# Altium project B100.PrjPcb (part 3 of 7)

## Sheet MicroController.SchDoc: MicroController Block Diagram
size A3; ApprovedBy: Mehmet Günce Akkoyun; CheckedBy: Mehmet Günce Akkoyun; CompanyName: Ovoo Electronics; DrawnBy: Mehmet Günce Akkoyun; Engineer: Mehmet Günce Akkoyun; Organization: Ovoo Electronics; Address1: Necip Fazıl Mah. Ortaırmak Sok.; Address2: Birgül Apt. No: 19/6; Address3: Meram / Konya; Address4: Turkiye; DocumentNumber: 14; Revision: R06; SheetNumber: 14; SheetTotal: 54
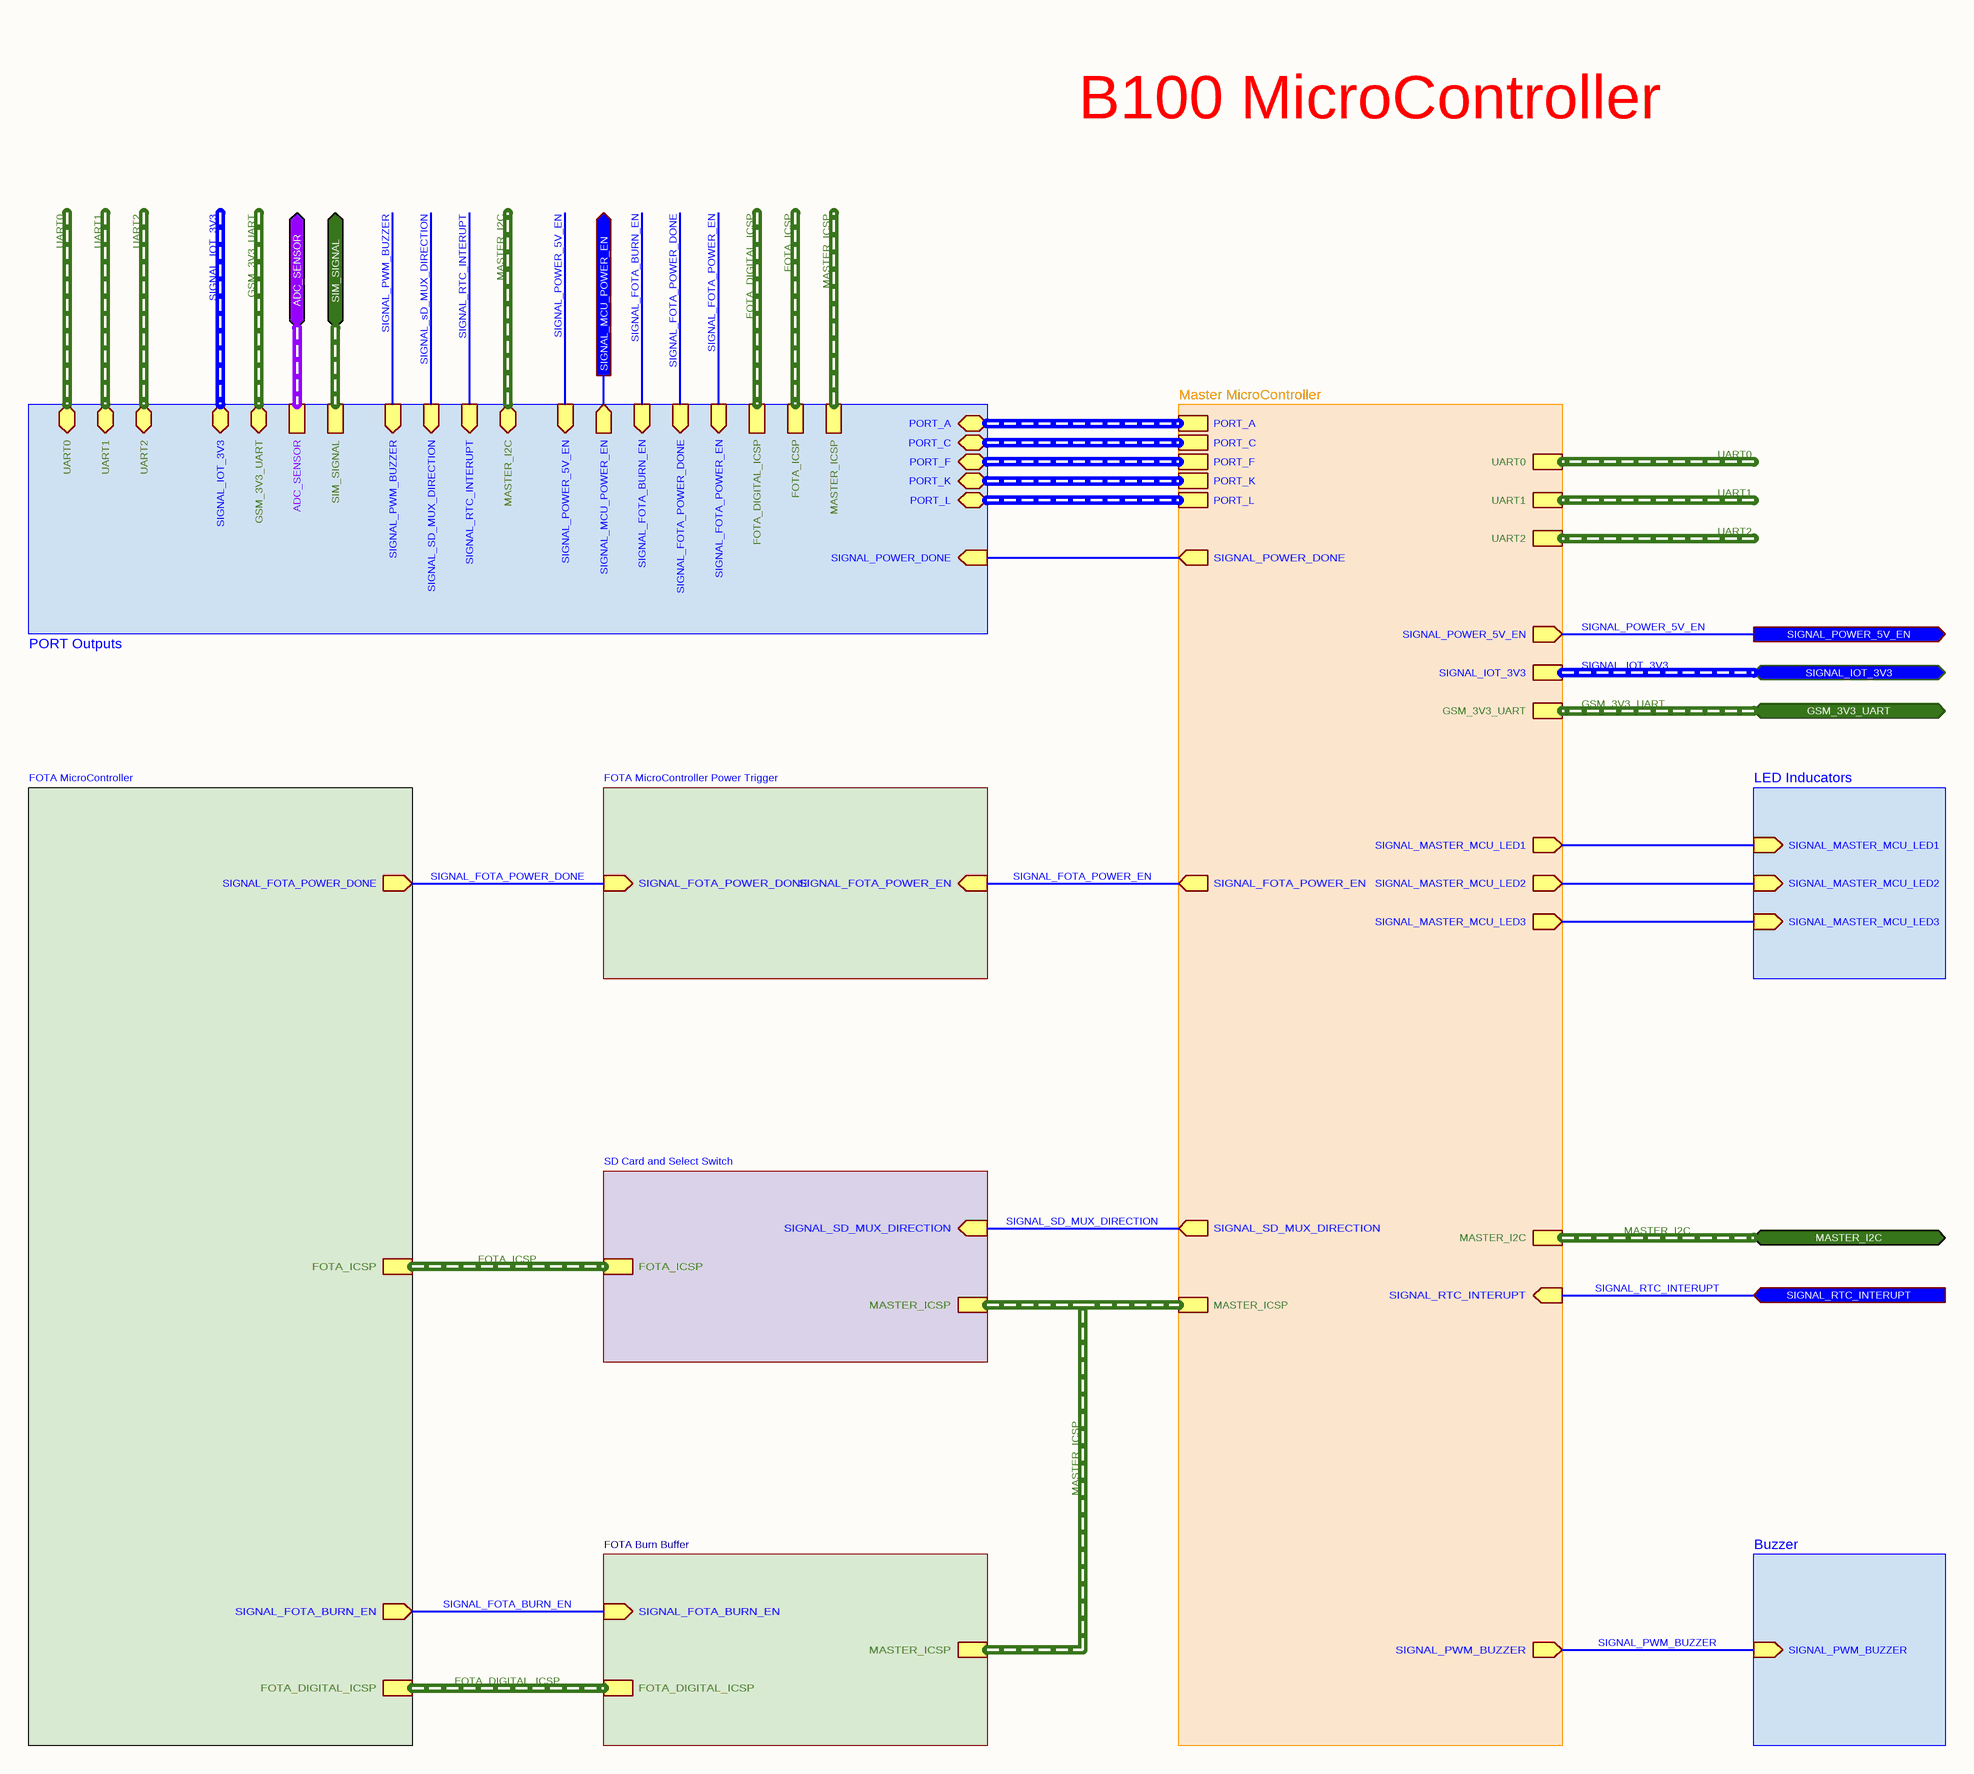
[diagram p18: MicroController.SchDoc]

### Sub-sheets
Buzzer = Buzzer.SchDoc: SIGNAL_PWM_BUZZER (in)
FOTA Burn Buffer = ICSP Burn Buffer.SchDoc: MASTER_ICSP (harness MASTER_ICSP), FOTA_DIGITAL_ICSP (harness FOTA_DIGITAL_ICSP), SIGNAL_FOTA_BURN_EN (in)
FOTA MicroController = FOTA MicroController.SchDoc: SIGNAL_FOTA_POWER_DONE (out), SIGNAL_FOTA_BURN_EN (out), FOTA_ICSP (harness FOTA_ICSP), FOTA_DIGITAL_ICSP (harness FOTA_DIGITAL_ICSP)
FOTA MicroController Power Trigger = FOTA MicroController Power Switch.SchDoc: SIGNAL_FOTA_POWER_DONE (in), SIGNAL_FOTA_POWER_EN (in)
LED Inducators = Master MicroController LED.SchDoc: SIGNAL_MASTER_MCU_LED1 (in), SIGNAL_MASTER_MCU_LED2 (in), SIGNAL_MASTER_MCU_LED3 (in)
Master MicroController = Master MicroController.SchDoc: SIGNAL_FOTA_POWER_EN (out), SIGNAL_POWER_DONE (out), SIGNAL_RTC_INTERUPT (in), SIGNAL_PWM_BUZZER (out), SIGNAL_SD_MUX_DIRECTION (out), UART1 (harness UART1), SIGNAL_MASTER_MCU_LED3 (out), PORT_A (harness PORT_A), UART0 (harness UART0), SIGNAL_MASTER_MCU_LED2 (out), MASTER_ICSP (harness MASTER_ICSP), PORT_K (harness PORT_K), UART2 (harness UART2), PORT_L (harness PORT_L), PORT_F (harness PORT_F), SIGNAL_IOT_3V3 (harness SIGNAL_IOT_3V3), SIGNAL_MASTER_MCU_LED1 (out), GSM_3V3_UART (harness GSM_3V3_UART), PORT_C (harness PORT_C), MASTER_I2C (harness MASTER_I2C), SIGNAL_POWER_5V_EN (out)
PORT Outputs = Module Output Sockets.SchDoc: PORT_A (bidir, harness PORT_A), PORT_F (bidir, harness PORT_F), PORT_C (bidir, harness PORT_C), PORT_K (bidir, harness PORT_K), PORT_L (bidir, harness PORT_L), SIGNAL_POWER_DONE (in), SIGNAL_FOTA_POWER_DONE (in), SIGNAL_FOTA_POWER_EN (in), FOTA_DIGITAL_ICSP (harness FOTA_DIGITAL_ICSP), SIGNAL_FOTA_BURN_EN (in), FOTA_ICSP (harness FOTA_ICSP), UART2 (bidir, harness UART2), UART1 (bidir, harness UART1), UART0 (bidir, harness UART0), MASTER_I2C (bidir, harness MASTER_I2C), MASTER_ICSP (harness MASTER_ICSP), SIGNAL_IOT_3V3 (bidir, harness SIGNAL_IOT_3V3), GSM_3V3_UART (bidir, harness GSM_3V3_UART), SIGNAL_PWM_BUZZER (in), SIGNAL_SD_MUX_DIRECTION (in), SIGNAL_RTC_INTERUPT (in), SIGNAL_MCU_POWER_EN (out), SIM_SIGNAL (harness SIM_SIGNAL), SIGNAL_POWER_5V_EN (in), ADC_SENSOR (harness ADC_SENSOR)
SD Card and Select Switch = SD Card.SchDoc: MASTER_ICSP (harness MASTER_ICSP), FOTA_ICSP (harness FOTA_ICSP), SIGNAL_SD_MUX_DIRECTION (in)

### Ports
ADC_SENSOR (bidir, harness ADC_SENSOR), GSM_3V3_UART (bidir, harness GSM_3V3_UART), MASTER_I2C (bidir, harness MASTER_I2C), SIGNAL_IOT_3V3 (bidir, harness SIGNAL_IOT_3V3), SIGNAL_MCU_POWER_EN (out), SIGNAL_POWER_5V_EN (out), SIGNAL_RTC_INTERUPT (in), SIM_SIGNAL (bidir, harness SIM_SIGNAL)

### Nets
SIGNAL_FOTA_BURN_EN: sheet PORT Outputs/SIGNAL_FOTA_BURN_EN, sheet FOTA Burn Buffer/SIGNAL_FOTA_BURN_EN, sheet FOTA MicroController/SIGNAL_FOTA_BURN_EN
SIGNAL_FOTA_POWER_DONE: sheet PORT Outputs/SIGNAL_FOTA_POWER_DONE, sheet FOTA MicroController Power Trigger/SIGNAL_FOTA_POWER_DONE, sheet FOTA MicroController/SIGNAL_FOTA_POWER_DONE
SIGNAL_FOTA_POWER_EN: sheet Master MicroController/SIGNAL_FOTA_POWER_EN, sheet PORT Outputs/SIGNAL_FOTA_POWER_EN, sheet FOTA MicroController Power Trigger/SIGNAL_FOTA_POWER_EN
SIGNAL_MASTER_MCU_LED1: sheet Master MicroController/SIGNAL_MASTER_MCU_LED1, sheet LED Inducators/SIGNAL_MASTER_MCU_LED1
SIGNAL_MASTER_MCU_LED2: sheet Master MicroController/SIGNAL_MASTER_MCU_LED2, sheet LED Inducators/SIGNAL_MASTER_MCU_LED2
SIGNAL_MASTER_MCU_LED3: sheet Master MicroController/SIGNAL_MASTER_MCU_LED3, sheet LED Inducators/SIGNAL_MASTER_MCU_LED3
SIGNAL_MCU_POWER_EN: port SIGNAL_MCU_POWER_EN, sheet PORT Outputs/SIGNAL_MCU_POWER_EN
SIGNAL_POWER_5V_EN: port SIGNAL_POWER_5V_EN, sheet Master MicroController/SIGNAL_POWER_5V_EN, sheet PORT Outputs/SIGNAL_POWER_5V_EN
SIGNAL_POWER_DONE: sheet Master MicroController/SIGNAL_POWER_DONE, sheet PORT Outputs/SIGNAL_POWER_DONE
SIGNAL_PWM_BUZZER: sheet Master MicroController/SIGNAL_PWM_BUZZER, sheet PORT Outputs/SIGNAL_PWM_BUZZER, sheet Buzzer/SIGNAL_PWM_BUZZER
SIGNAL_RTC_INTERUPT: port SIGNAL_RTC_INTERUPT, sheet Master MicroController/SIGNAL_RTC_INTERUPT, sheet PORT Outputs/SIGNAL_RTC_INTERUPT
SIGNAL_SD_MUX_DIRECTION: sheet Master MicroController/SIGNAL_SD_MUX_DIRECTION, sheet PORT Outputs/SIGNAL_SD_MUX_DIRECTION, sheet SD Card and Select Switch/SIGNAL_SD_MUX_DIRECTION

### Buses and harness runs
harness FOTA_DIGITAL_ICSP = sheet FOTA Burn Buffer/FOTA_DIGITAL_ICSP = sheet FOTA MicroController/FOTA_DIGITAL_ICSP
harness FOTA_DIGITAL_ICSP = sheet PORT Outputs/FOTA_DIGITAL_ICSP
harness FOTA_ICSP = sheet FOTA MicroController/FOTA_ICSP = sheet SD Card and Select Switch/FOTA_ICSP
harness FOTA_ICSP = sheet PORT Outputs/FOTA_ICSP
harness GSM_3V3_UART = port GSM_3V3_UART = sheet Master MicroController/GSM_3V3_UART
harness GSM_3V3_UART = sheet PORT Outputs/GSM_3V3_UART
harness MASTER_I2C = port MASTER_I2C = sheet Master MicroController/MASTER_I2C
harness MASTER_I2C = sheet PORT Outputs/MASTER_I2C
harness MASTER_ICSP = sheet FOTA Burn Buffer/MASTER_ICSP = sheet Master MicroController/MASTER_ICSP = sheet SD Card and Select Switch/MASTER_ICSP
harness MASTER_ICSP = sheet PORT Outputs/MASTER_ICSP
harness port ADC_SENSOR = sheet PORT Outputs/ADC_SENSOR
harness port SIM_SIGNAL = sheet PORT Outputs/SIM_SIGNAL
harness sheet Master MicroController/PORT_A = sheet PORT Outputs/PORT_A
harness sheet Master MicroController/PORT_C = sheet PORT Outputs/PORT_C
harness sheet Master MicroController/PORT_F = sheet PORT Outputs/PORT_F
harness sheet Master MicroController/PORT_K = sheet PORT Outputs/PORT_K
harness sheet Master MicroController/PORT_L = sheet PORT Outputs/PORT_L
harness SIGNAL_IOT_3V3 = port SIGNAL_IOT_3V3 = sheet Master MicroController/SIGNAL_IOT_3V3
harness SIGNAL_IOT_3V3 = sheet PORT Outputs/SIGNAL_IOT_3V3
harness UART0 = sheet Master MicroController/UART0
harness UART0 = sheet PORT Outputs/UART0
harness UART1 = sheet Master MicroController/UART1
harness UART1 = sheet PORT Outputs/UART1
harness UART2 = sheet Master MicroController/UART2
harness UART2 = sheet PORT Outputs/UART2

### Notes on the sheet
- B100 MicroController
- Engineer
- All Rights are reserved to Customer and Engineer. [2021]
- Size:
- Date:
- A3
- Project :
- Time:
- Sheet
- of
- Customer
- Product ID
- Module ID
- Version
- File:
- Revision

## Sheet Master MicroController.SchDoc: Master Micro Controller
size A3; ApprovedBy: Mehmet Günce Akkoyun; CheckedBy: Mehmet Günce Akkoyun; Author: Mehmet Günce Akkoyun; CompanyName: Ovoo Electronics; DrawnBy: Mehmet Günce Akkoyun; Engineer: Mehmet Günce Akkoyun; Organization: Ovoo Electronics; Address1: Necip Fazıl Mah. Ortaırmak Sok.; Address2: Birgül Apt. No: 19/6; Address3: Meram / Konya; Address4: Turkiye; DocumentNumber: 13; Revision: R06; SheetNumber: 13; SheetTotal: 54
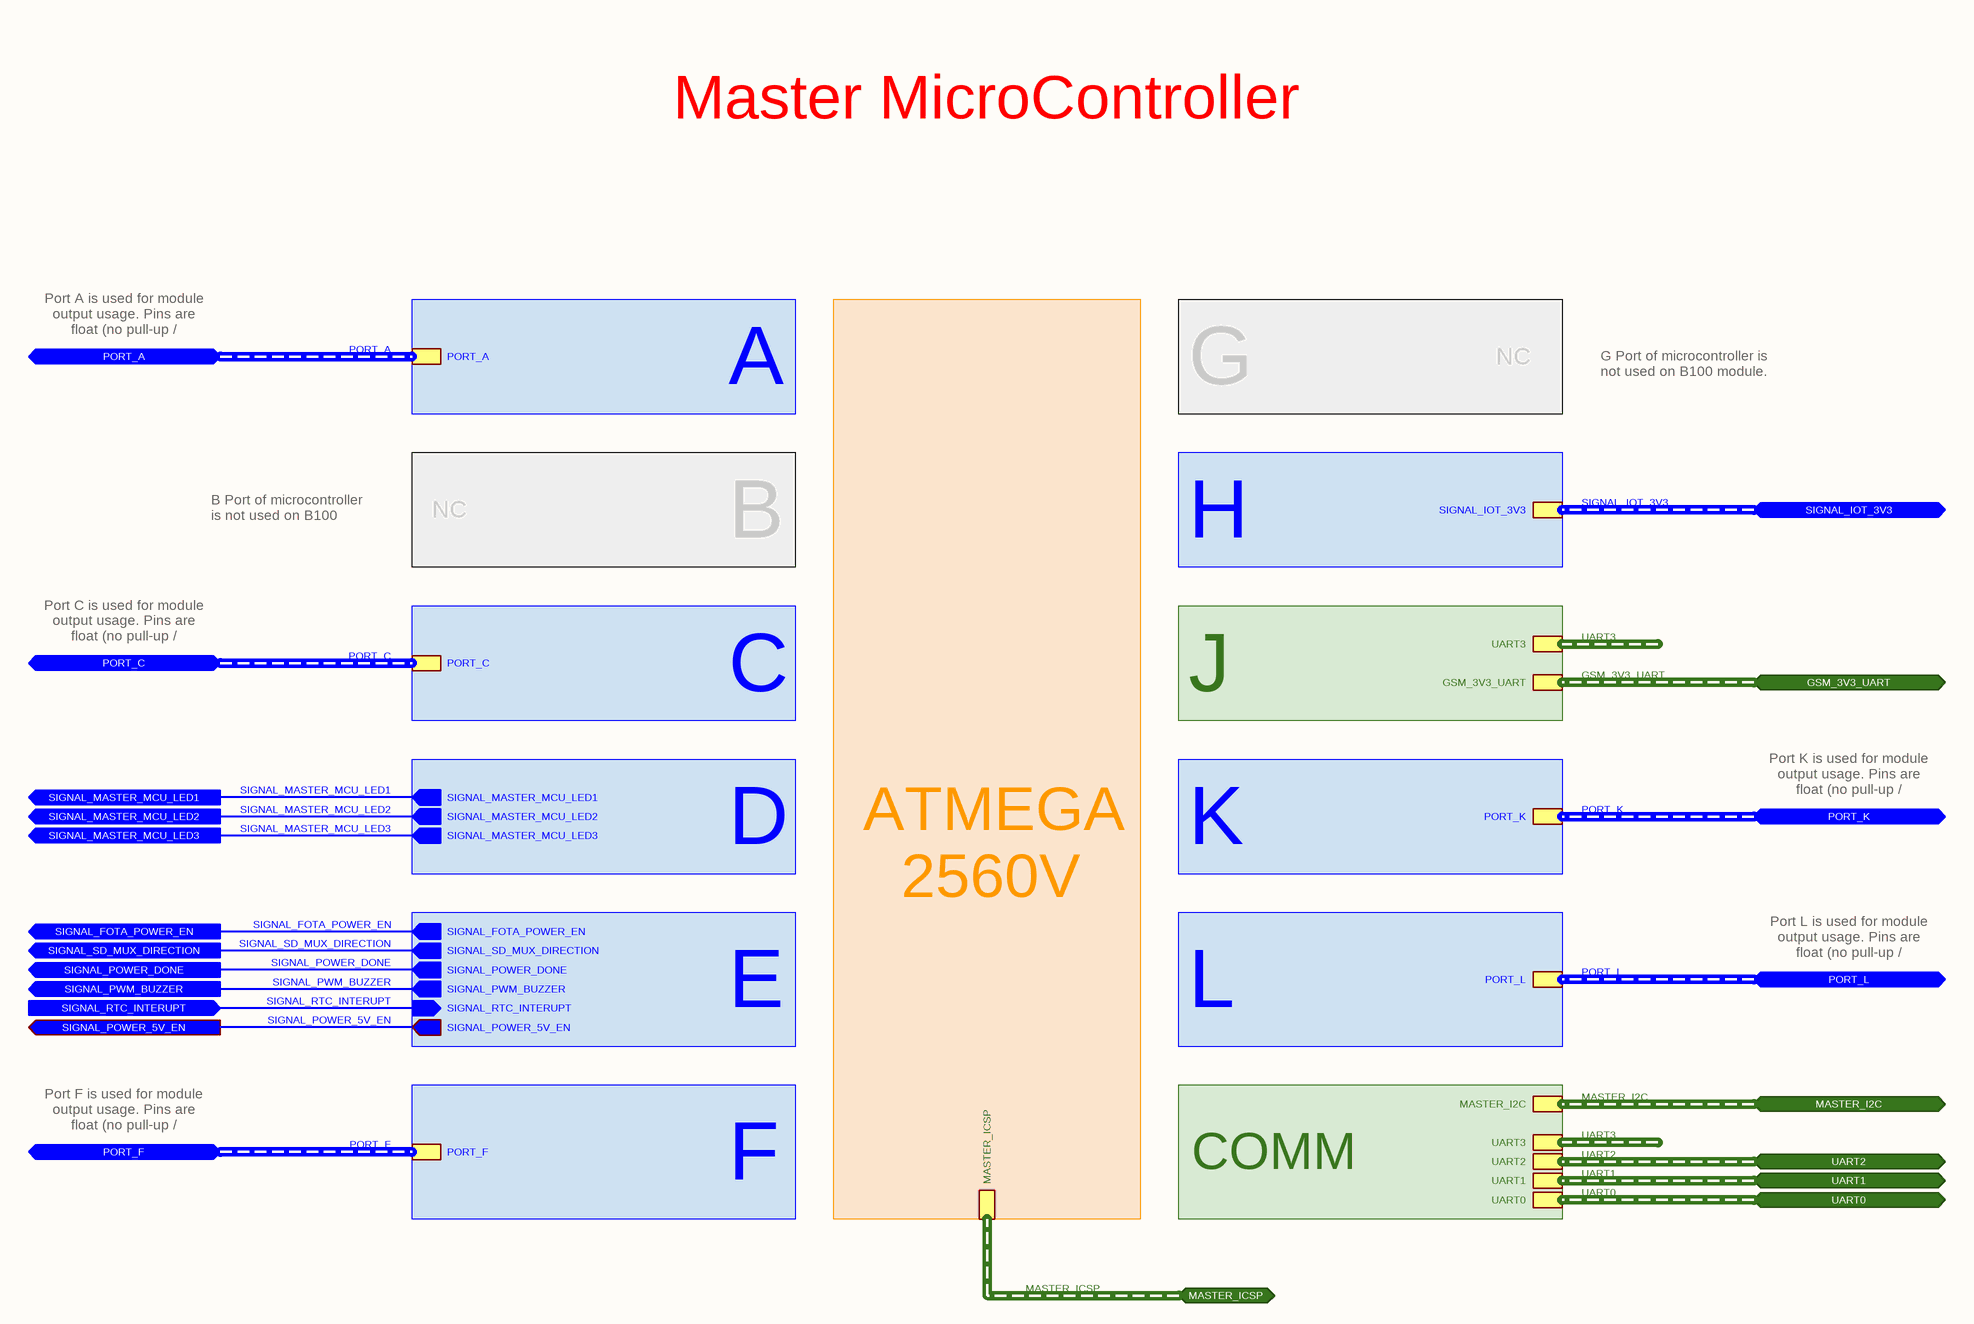
[diagram p19: Master MicroController.SchDoc]

### Sub-sheets
Master MicroController Core = Master MicroController Core.SchDoc: MASTER_ICSP (harness MASTER_ICSP)
PORT A = Master MicroController Port A.SchDoc: PORT_A (harness PORT_A)
PORT B = Master MicroController Port B.SchDoc: no entries
PORT C = Master MicroController Port C.SchDoc: PORT_C (harness PORT_C)
PORT D = Master MicroController Port D.SchDoc: SIGNAL_MASTER_MCU_LED1 (out), SIGNAL_MASTER_MCU_LED3 (out), SIGNAL_MASTER_MCU_LED2 (out)
PORT E = Master MicroController Port E.SchDoc: SIGNAL_FOTA_POWER_EN (out), SIGNAL_SD_MUX_DIRECTION (out), SIGNAL_PWM_BUZZER (out), SIGNAL_RTC_INTERUPT (in), SIGNAL_POWER_DONE (out), SIGNAL_POWER_5V_EN (out)
PORT F = Master MicroController Port F.SchDoc: PORT_F (harness PORT_F)
PORT G = Master MicroController Port G.SchDoc: no entries
PORT H = Master MicroController Port H.SchDoc: SIGNAL_IOT_3V3 (harness SIGNAL_IOT_3V3)
PORT J = Master MicroController Port J.SchDoc: GSM_3V3_UART (harness GSM_3V3_UART), UART3 (harness UART3)
PORT K = Master MicroController Port K.SchDoc: PORT_K (harness PORT_K)
PORT L = Master MicroController Port L.SchDoc: PORT_L (harness PORT_L)
Serial Communication = Master MicroController Serial Communication Port.SchDoc: UART3 (harness UART3), UART1 (harness UART1), UART2 (harness UART2), UART0 (harness UART0), MASTER_I2C (harness MASTER_I2C)

### Ports
GSM_3V3_UART (bidir, harness GSM_3V3_UART), MASTER_I2C (bidir, harness MASTER_I2C), MASTER_ICSP (bidir, harness MASTER_ICSP), PORT_A (bidir, harness PORT_A), PORT_C (bidir, harness PORT_C), PORT_F (bidir, harness PORT_F), PORT_K (bidir, harness PORT_K), PORT_L (bidir, harness PORT_L), SIGNAL_FOTA_POWER_EN (out), SIGNAL_IOT_3V3 (bidir, harness SIGNAL_IOT_3V3), SIGNAL_MASTER_MCU_LED1 (out), SIGNAL_MASTER_MCU_LED2 (out), SIGNAL_MASTER_MCU_LED3 (out), SIGNAL_POWER_5V_EN (out), SIGNAL_POWER_DONE (out), SIGNAL_PWM_BUZZER (out), SIGNAL_RTC_INTERUPT (in), SIGNAL_SD_MUX_DIRECTION (out), UART0 (bidir, harness UART0), UART1 (bidir, harness UART1), UART2 (bidir, harness UART2)

### Nets
SIGNAL_FOTA_POWER_EN: port SIGNAL_FOTA_POWER_EN, sheet PORT E/SIGNAL_FOTA_POWER_EN
SIGNAL_MASTER_MCU_LED1: port SIGNAL_MASTER_MCU_LED1, sheet PORT D/SIGNAL_MASTER_MCU_LED1
SIGNAL_MASTER_MCU_LED2: port SIGNAL_MASTER_MCU_LED2, sheet PORT D/SIGNAL_MASTER_MCU_LED2
SIGNAL_MASTER_MCU_LED3: port SIGNAL_MASTER_MCU_LED3, sheet PORT D/SIGNAL_MASTER_MCU_LED3
SIGNAL_POWER_5V_EN: port SIGNAL_POWER_5V_EN, sheet PORT E/SIGNAL_POWER_5V_EN
SIGNAL_POWER_DONE: port SIGNAL_POWER_DONE, sheet PORT E/SIGNAL_POWER_DONE
SIGNAL_PWM_BUZZER: port SIGNAL_PWM_BUZZER, sheet PORT E/SIGNAL_PWM_BUZZER
SIGNAL_RTC_INTERUPT: port SIGNAL_RTC_INTERUPT, sheet PORT E/SIGNAL_RTC_INTERUPT
SIGNAL_SD_MUX_DIRECTION: port SIGNAL_SD_MUX_DIRECTION, sheet PORT E/SIGNAL_SD_MUX_DIRECTION

### Buses and harness runs
harness GSM_3V3_UART = port GSM_3V3_UART = sheet PORT J/GSM_3V3_UART
harness MASTER_I2C = port MASTER_I2C = sheet Serial Communication/MASTER_I2C
harness MASTER_ICSP = port MASTER_ICSP = sheet Master MicroController Core/MASTER_ICSP
harness PORT_A = port PORT_A = sheet PORT A/PORT_A
harness PORT_C = port PORT_C = sheet PORT C/PORT_C
harness PORT_F = port PORT_F = sheet PORT F/PORT_F
harness PORT_K = port PORT_K = sheet PORT K/PORT_K
harness PORT_L = port PORT_L = sheet PORT L/PORT_L
harness SIGNAL_IOT_3V3 = port SIGNAL_IOT_3V3 = sheet PORT H/SIGNAL_IOT_3V3
harness UART0 = port UART0 = sheet Serial Communication/UART0
harness UART1 = port UART1 = sheet Serial Communication/UART1
harness UART2 = port UART2 = sheet Serial Communication/UART2
harness UART3 = sheet PORT J/UART3
harness UART3 = sheet Serial Communication/UART3

### Notes on the sheet
- Master MicroController
- Port A is used for module output usage. Pins are float (no pull-up / pull-down)
- A
- G
- NC
- G Port of microcontroller is not used on B100 module.
- B Port of microcontroller is not used on B100 module.
- B
- H
- Port C is used for module output usage. Pins are float (no pull-up / pull-down)
- C
- J
- Port K is used for module output usage. Pins are float (no pull-up / pull-down)
- D
- ATMEGA
- 2560V
- K
- Port L is used for module output usage. Pins are float (no pull-up / pull-down)
- E
- L
- Port F is used for module output usage. Pins are float (no pull-up / pull-down)
- F
- COMM
- Title
- Size:
- Date:
- A3
- Number:
- Time:
- Revision:
- Sheet
- of
- File:

## Sheet Master MicroController Core.SchDoc: Master MicroController Core
size A4; ApprovedBy: Mehmet Günce Akkoyun; CheckedBy: Mehmet Günce Akkoyun; Author: Mehmet Günce Akkoyun; CompanyName: Ovoo Electronics; DrawnBy: Mehmet Günce Akkoyun; Engineer: Mehmet Günce Akkoyun; Organization: Ovoo Electronics; Address1: Necip Fazıl Mah. Ortaırmak Sok.; Address2: Birgül Apt. No: 19/6; Address3: Meram / Konya; Address4: Turkiye; DocumentNumber: 15; Revision: R06; SheetNumber: 15; SheetTotal: 54
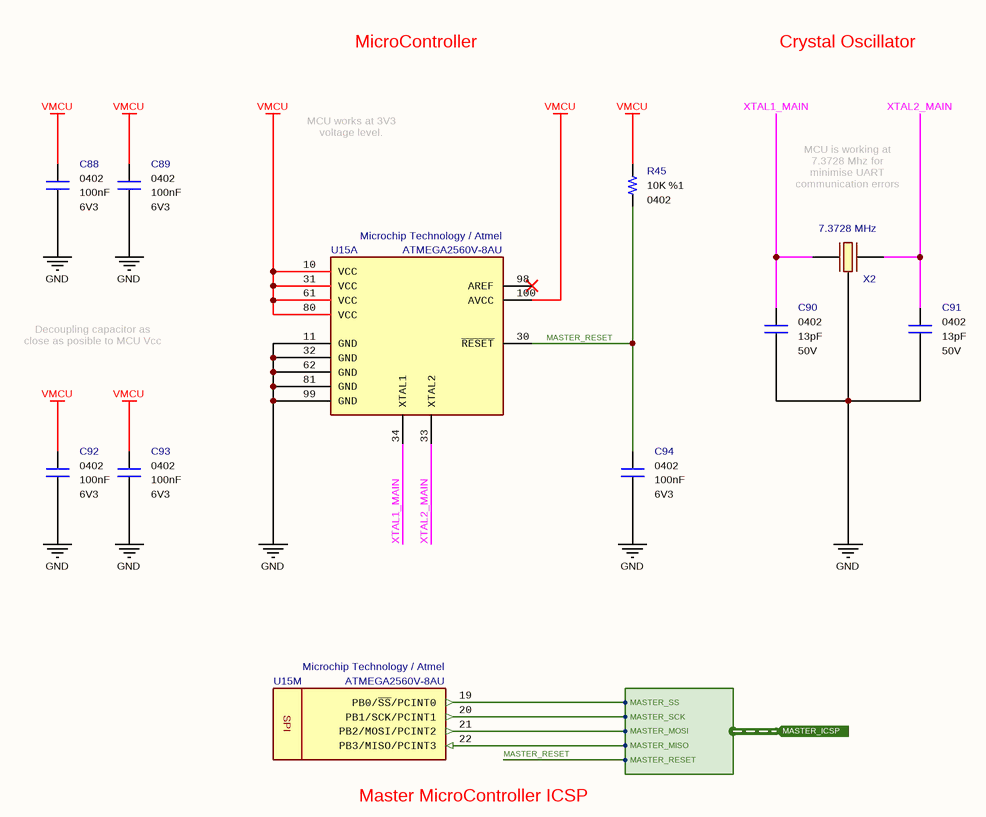
[diagram p20: Master MicroController Core.SchDoc]

### Parts
C88  value 100nF  Case: 0402  Voltage: 6V3  [CAPACITOR_0402]  (hidden comment: Multilayer Ceramic Capacitor)
C89  value 100nF  Case: 0402  Voltage: 6V3  [CAPACITOR_0402]  (hidden comment: Multilayer Ceramic Capacitor)
C90  value 13pF  Voltage: 50V  Case: 0402  [CAPACITOR_0402]  (hidden comment: Multilayer Ceramic Capacitor)
C91  value 13pF  Voltage: 50V  Case: 0402  [CAPACITOR_0402]  (hidden comment: Multilayer Ceramic Capacitor)
C92  value 100nF  Case: 0402  Voltage: 6V3  [CAPACITOR_0402]  (hidden comment: Multilayer Ceramic Capacitor)
C93  value 100nF  Case: 0402  Voltage: 6V3  [CAPACITOR_0402]  (hidden comment: Multilayer Ceramic Capacitor)
C94  value 100nF  Case: 0402  Voltage: 6V3  [CAPACITOR_0402]  (hidden comment: Multilayer Ceramic Capacitor)
R45  value 10K  Tolerance: %1  Case: 0402  [RESISTOR_0402]  (hidden comment: Thick Film Resistor)
U15  Manufacturer Part Number: ATMEGA2560V-8AU  Manufacturer Name: Microchip Technology / Atmel  [TQFP100]  (hidden comment: 8-bit MicroController)  (parts A,M of 15)
X2  7.3728 MHz  [ABRACON_CRYSTAL]

### Ports
MASTER_ICSP (in, harness MASTER_ICSP)

### Harnesses
MASTER_ICSP: MASTER_RESET, MASTER_SCK, MASTER_MISO, MASTER_MOSI, MASTER_SS

### Nets
GND: C88.1 C89.1 C90.1 C91.1 C92.1 C93.1 C94.1 U15.11(GND) U15.32(GND) U15.62(GND) U15.81(GND) U15.99(GND) X2.2(GND)
VMCU: C88.2 C89.2 C92.2 C93.2 R45.2 U15.10(VCC) U15.31(VCC) U15.61(VCC) U15.80(VCC) U15.100(AVCC)
MASTER_ICSP.MASTER_MISO: U15.22(PB3/MISO/PCINT3) ; port MASTER_ICSP.MASTER_MISO
MASTER_ICSP.MASTER_MOSI: U15.21(PB2/MOSI/PCINT2) ; port MASTER_ICSP.MASTER_MOSI
MASTER_ICSP.MASTER_SCK: U15.20(PB1/SCK/PCINT1) ; port MASTER_ICSP.MASTER_SCK
MASTER_ICSP.MASTER_SS: U15.19(PB0/~{SS}/PCINT0) ; port MASTER_ICSP.MASTER_SS
MASTER_RESET: C94.2 R45.1 U15.30(~{RESET}) ; port MASTER_ICSP.MASTER_RESET  [project net MASTER_ICSP.MASTER_RESET]
XTAL1_MAIN: C90.2 U15.34(XTAL1) X2.3(OUT/IN)
XTAL2_MAIN: C91.2 U15.33(XTAL2) X2.1(IN/OUT)

Not connected (* = marked no-connect by the designer): U15 98(AREF)*; X2 4(GND)

### Notes on the sheet
- MicroController
- Crystal Oscillator
- MCU works at 3V3 voltage level.
- MCU is working at 7.3728 Mhz for minimise UART communication errors (115200bps).
- Decoupling capacitor as close as posible to MCU Vcc pins.
- (near U15) Master MicroController ICSP
- Engineer
- All Rights are reserved to Customer and Engineer. [2021]
- Size:
- Date:
- A4
- Project :
- Time:
- Sheet
- of
- Customer
- Product ID
- Module ID
- Version
- File:
- Revision
- (in symbol IC - ATMEGA2560V-8AU, part M) SPI

### Library data of the parts
C88 C89 C92-C94 = Capacitor - 100nF [0402-6V3]: Capacitor - 100nF [0402-6V3] (Ceramic); Manufacturer Name: AVX; Manufacturer Part Number: 04026D104KAT4A; Dielectric: X5R; Tolerance: %10; Height: 0.25mm; ComponentLink1Description: Mouser; ComponentLink1URL: https://www.mouser.com.tr/ProductDetail/AVX/04026D104KAT4A?qs=sGAEpiMZZMs0AnBnWHyRQPg4iYkCw7IMED%2F4kpqgf7w%3D; ComponentLink2Description: DataSheet; ComponentLink2URL: https://www.mouser.com.tr/datasheet/2/40/cx5r-776519.pdf; ROHS: Yes; Maximum Operating Temperature: +85; Minimum Operating Temperature: -55; Supplier 1: Avnet; Supplier Part Number 1: 04026D104KAT4A; Mouser Part Number: 581-04026D104KAT4A
C90 C91 = Capacitor - 13pF [0402-50V]: Capacitor - 13pF [0402] (Ceramic); Manufacturer Name: Kemet; Manufacturer Part Number: CBR04C130F5GAC; Dielectric: C0G; Tolerance: 1%; Height: 0.55mm; ROHS: Yes; Weight: 0.65mg; ComponentLink1Description: DataSheet; ComponentLink1URL: http://www.kemet.com/Lists/ProductCatalog/Attachments/490/KEM_C1030_CBR_SMD.pdf; ComponentLink2Description: Mouser; ComponentLink2URL: http://www.mouser.com/Search/ProductDetail.aspx?qs=kSX8PZDGYstn%252bRHasf81FA%3d%3d; Supplier 1: Mouser; Supplier 2: Farnell; Supplier 3: Digi-Key; Supplier Part Number 3: 399-8812-1-ND; Supplier Part Number 2: 2773390; Supplier Part Number 1: 80-CBR04C130F5GAC; Mouser Part Number: 80-CBR04C130F5GAC
R45 = Resistor - 10K: Thick Film Resistors - SMD 1/16 W 10 Kohms 1%; Manufacturer Name: Vishay; Manufacturer Part Number: CRCW040210K0FKED; Height: 0.4mm; ComponentLink1Description: DataSheet; ComponentLink1URL: https://www.mouser.com.tr/datasheet/2/427/dcrcwe3-1762152.pdf; ComponentLink2Description: Mouser; ComponentLink2URL: https://www.mouser.com.tr/ProductDetail/Vishay-Dale/CRCW040210K0FKED?qs=sGAEpiMZZMu61qfTUdNhG2DpbjADlD3GcalbOv9utCY%3D; Supplier 1: Mouser; Supplier 2: Digi-Key; Supplier Part Number 1: 71-CRCW040210K0FKEDH; Supplier Part Number 2: 541-10.0KYCT-ND; Mouser Part Number: 71-CRCW0402-10K-E3
U15 = IC - ATMEGA2560V-8AU: 8-bit Microcontrollers - MCU 256kB Flash 4kB EEPROM 86 I/O Pins; Supply Voltage - Min: 2V7; Supply Voltage - Max: 5.5V; Height: 1mm; ComponentLink1Description: DataSheet; ComponentLink1URL: https://eu.mouser.com/datasheet/2/268/Atmel-2549-8-bit-AVR-Microcontroller-ATmega640-128-1315286.pdf; ROHS: Yes; Minimum Operating Temperature: -40; Maximum Operating Temperature: +85; ComponentLink2Description: Mouser; ComponentLink2URL: https://eu.mouser.com/ProductDetail/Microchip-Technology-Atmel/ATMEGA2560V-8AU?qs=sGAEpiMZZMutXGli8Ay4kKlCYcvZUWqJYdtgGFyqFT8%3D; Supplier 1: Digi-Key; Supplier 2: Newark; Supplier 3: Avnet; Supplier 4: RSComponents; Supplier 5: RSComponents; Supplier Part Number 1: ATMEGA2560V-8AU-ND; Supplier Part Number 2: 68T2784; Supplier Part Number 3: 68T2784; Supplier Part Number 4: 1278284P; Supplier Part Number 5: 1278284; Case: TQFP-100; Supplier 6: Mouser; Supplier 7: Future Electronics; Supplier 8: Avnet; Supplier 9: Arrow Electronics; Supplier 10: Farnell; Supplier 11: Allied Electronics; Supplier 12: Future Electronics; Supplier 13: RSComponents; Supplier 14: RSComponents; Supplier 15: RSComponents; Supplier Part Number 6: 556-ATMEGA2560V8AU; Supplier Part Number 7: 4038198; Supplier Part Number 8: ATMEGA2560V-8AU; Supplier Part Number 9: ATMEGA2560V-8AU; Supplier Part Number 10: 1288331; Supplier Part Number 11: 70124009; Supplier Part Number 12: ATMEGA2560V-8AU-TRAY; Supplier Part Number 13: 6963424; Supplier Part Number 14: 6963424P; Supplier Part Number 15: 9220809
X2 = Crystal - 7.3728 MHz (Abracon): Crystals 7.3728MHz 18pF -40C +85C; Manufacturer Part Number: ABMM2-7.3728MHZ-E2-T; ESR: 150 Ohms; Frequency Stability: 20 ppm; Height: 1.2 mm; Manufacturer Name: ABRACON; Mouser Part Number: 815-ABMM2-7.3-E2-T; Frequency: 7.3728 MHz; Maximum Operating Temperature: +70; Minimum Operating Temperature: -20; ROHS: Yes; Tolerance: 20 ppm; ComponentLink1Description: DataSheet; ComponentLink1URL: https://www.ecsxtal.com/store/pdf/csm-8mr.pdf; ComponentLink2Description: Mouser; ComponentLink2URL: https://www.mouser.com/Search/Refine.aspx?Keyword=520-7.3-18-20BM-JENT; Supplier 1: Mouser; Supplier 2: Arrow; Supplier Part Number 2: ABMM2-7.3728MHZ-E2-T; Supplier Part Number 1: 815-ABMM2-7.3-E2-T; Case: SMD

## Sheet Master MicroController Port A.SchDoc: Master Micro Controller Port A Pin Out
size A4; ApprovedBy: Mehmet Günce Akkoyun; CheckedBy: Mehmet Günce Akkoyun; Author: Mehmet Günce Akkoyun; CompanyName: Ovoo Electronics; DrawnBy: Mehmet Günce Akkoyun; Engineer: Mehmet Günce Akkoyun; Organization: Ovoo Electronics; Address1: Necip Fazıl Mah. Ortaırmak Sok.; Address2: Birgül Apt. No: 19/6; Address3: Meram / Konya; Address4: Turkiye; DocumentNumber: 16; Revision: R06; SheetNumber: 16; SheetTotal: 54
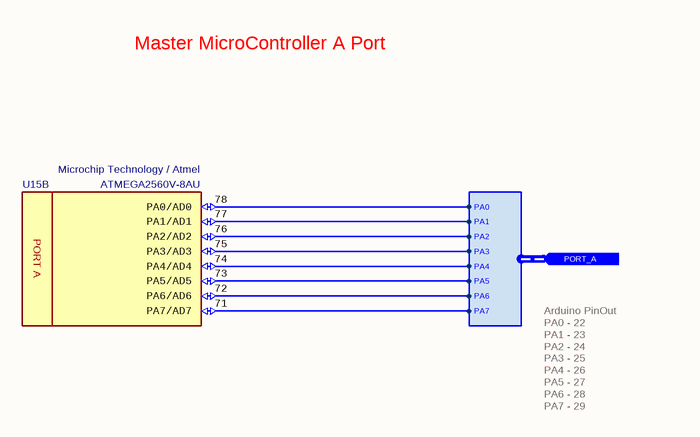
[diagram p21: Master MicroController Port A.SchDoc]

### Parts
U15  Manufacturer Part Number: ATMEGA2560V-8AU  Manufacturer Name: Microchip Technology / Atmel  [TQFP100]  (hidden comment: 8-bit MicroController)  (part B of 15)

### Ports
PORT_A (in, harness PORT_A)

### Harnesses
PORT_A: PA0, PA1, PA2, PA3, PA4, PA5, PA7, PA6

### Nets
PORT_A.PA0: U15.78(PA0/AD0) ; port PORT_A.PA0
PORT_A.PA1: U15.77(PA1/AD1) ; port PORT_A.PA1
PORT_A.PA2: U15.76(PA2/AD2) ; port PORT_A.PA2
PORT_A.PA3: U15.75(PA3/AD3) ; port PORT_A.PA3
PORT_A.PA4: U15.74(PA4/AD4) ; port PORT_A.PA4
PORT_A.PA5: U15.73(PA5/AD5) ; port PORT_A.PA5
PORT_A.PA6: U15.72(PA6/AD6) ; port PORT_A.PA6
PORT_A.PA7: U15.71(PA7/AD7) ; port PORT_A.PA7

### Notes on the sheet
- Master MicroController A Port
- Arduino PinOut
  PA0 - 22
  PA1 - 23
  PA2 - 24
  PA3 - 25
  PA4 - 26
  PA5 - 27
  PA6 - 28
  PA7 - 29
- Engineer
- All Rights are reserved to Customer and Engineer. [2021]
- Size:
- Date:
- A4
- Project :
- Time:
- Sheet
- of
- Customer
- Product ID
- Module ID
- Version
- File:
- Revision
- (in symbol IC - ATMEGA2560V-8AU, part B) PORT A

### Library data of the parts
U15 = IC - ATMEGA2560V-8AU: as U15 on sheet Master MicroController Core; Height: 1mm; ComponentLink1Description: DataSheet; ComponentLink1URL: https://eu.mouser.com/datasheet/2/268/Atmel-2549-8-bit-AVR-Microcontroller-ATmega640-128-1315286.pdf; ROHS: Yes; Minimum Operating Temperature: -40; Maximum Operating Temperature: +85; ComponentLink2Description: Mouser; ComponentLink2URL: https://eu.mouser.com/ProductDetail/Microchip-Technology-Atmel/ATMEGA2560V-8AU?qs=sGAEpiMZZMutXGli8Ay4kKlCYcvZUWqJYdtgGFyqFT8%3D; Supplier 1: Digi-Key; Supplier 2: Newark; Supplier 3: Avnet; Supplier 4: RSComponents; Supplier 5: RSComponents; Supplier Part Number 1: ATMEGA2560V-8AU-ND; Supplier Part Number 2: 68T2784; Supplier Part Number 3: 68T2784; Supplier Part Number 4: 1278284P; Supplier Part Number 5: 1278284; Case: TQFP-100; Supplier 6: Mouser; Supplier 7: Future Electronics; Supplier 8: Avnet; Supplier 9: Arrow Electronics; Supplier 10: Farnell; Supplier 11: Allied Electronics; Supplier 12: Future Electronics; Supplier 13: RSComponents; Supplier 14: RSComponents; Supplier 15: RSComponents; Supplier Part Number 6: 556-ATMEGA2560V8AU; Supplier Part Number 7: 4038198; Supplier Part Number 8: ATMEGA2560V-8AU; Supplier Part Number 9: ATMEGA2560V-8AU; Supplier Part Number 10: 1288331; Supplier Part Number 11: 70124009; Supplier Part Number 12: ATMEGA2560V-8AU-TRAY; Supplier Part Number 13: 6963424; Supplier Part Number 14: 6963424P; Supplier Part Number 15: 9220809

## Sheet Master MicroController Port B.SchDoc: Master Micro Controller Port B Pin Out
size A4; ApprovedBy: Mehmet Günce Akkoyun; CheckedBy: Mehmet Günce Akkoyun; Author: Mehmet Günce Akkoyun; CompanyName: Ovoo Electronics; DrawnBy: Mehmet Günce Akkoyun; Engineer: Mehmet Günce Akkoyun; Organization: Ovoo Electronics; Address1: Necip Fazıl Mah. Ortaırmak Sok.; Address2: Birgül Apt. No: 19/6; Address3: Meram / Konya; Address4: Turkiye; DocumentNumber: 17; Revision: R06; SheetNumber: 17; SheetTotal: 54
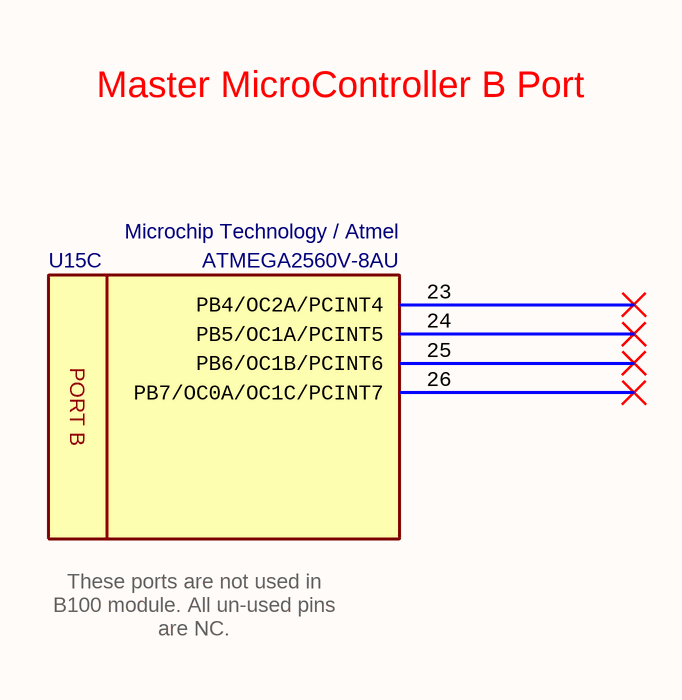
[diagram p22: Master MicroController Port B.SchDoc]

### Parts
U15  Manufacturer_Part_Number: ATMEGA2560V-8AU  Manufacturer_Name: Microchip Technology / Atmel  [TQFP100]  (hidden comment: 8-bit MicroController)  (part C of 15)

### Nets

Not connected (* = marked no-connect by the designer): U15 23(PB4/OC2A/PCINT4)* 24(PB5/OC1A/PCINT5)* 25(PB6/OC1B/PCINT6)* 26(PB7/OC0A/OC1C/PCINT7)*

### Notes on the sheet
- Master MicroController B Port
- These ports are not used in B100 module. All un-used pins are NC.
- Title
- Size:
- Date:
- A4
- Number:
- Time:
- Revision:
- Sheet
- of
- File:
- (in symbol IC - ATMEGA2560V-8AU, part C) PORT B

### Library data of the parts
U15 = IC - ATMEGA2560V-8AU: as U15 on sheet Master MicroController Core; Height: 1mm; Mouser_Part_Number: 556-ATMEGA2560V8AU; ComponentLink1Description: DataSheet; ComponentLink1URL: https://eu.mouser.com/datasheet/2/268/Atmel-2549-8-bit-AVR-Microcontroller-ATmega640-128-1315286.pdf; ROHS: Yes; Minimum Operating Temperature: -40; Maximum Operating Temperature: +85; ComponentLink2Description: Mouser; ComponentLink2URL: https://eu.mouser.com/ProductDetail/Microchip-Technology-Atmel/ATMEGA2560V-8AU?qs=sGAEpiMZZMutXGli8Ay4kKlCYcvZUWqJYdtgGFyqFT8%3D; Supplier 1: Mouser; Supplier 2: Arrow; Supplier 3: Farnell; Supplier 4: Newark; Supplier 5: Digi-Key; Supplier Part Number 1: 556-ATMEGA2560V8AU; Supplier Part Number 2: ATMEGA2560V-8AU; Supplier Part Number 3: 1288331; Supplier Part Number 4: 68T2784; Supplier Part Number 5: ATMEGA2560V-8AU-ND; Case: TQFP-100

## Sheet Master MicroController Port C.SchDoc: Master Micro Controller Port C Pin Out
size A4; ApprovedBy: Mehmet Günce Akkoyun; CheckedBy: Mehmet Günce Akkoyun; Author: Mehmet Günce Akkoyun; CompanyName: Ovoo Electronics; DrawnBy: Mehmet Günce Akkoyun; Engineer: Mehmet Günce Akkoyun; Organization: Ovoo Electronics; Address1: Necip Fazıl Mah. Ortaırmak Sok.; Address2: Birgül Apt. No: 19/6; Address3: Meram / Konya; Address4: Turkiye; DocumentNumber: 18; Revision: R06; SheetNumber: 18; SheetTotal: 54
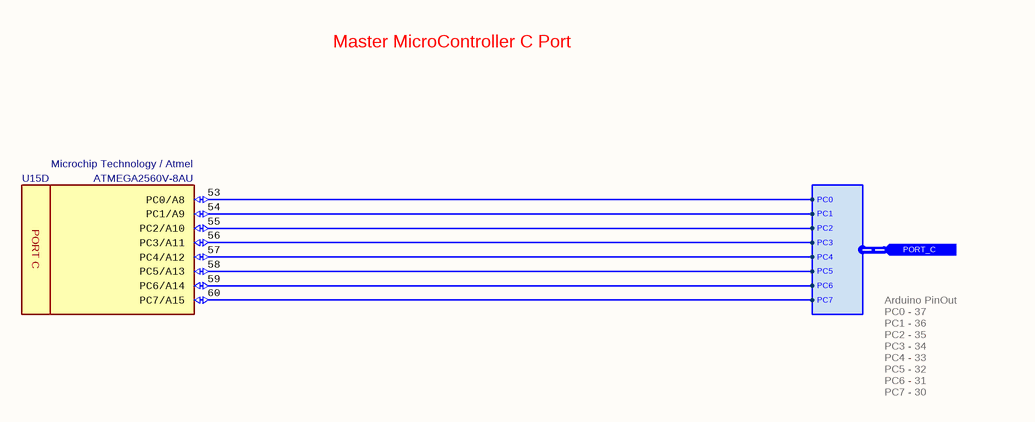
[diagram p23: Master MicroController Port C.SchDoc]

### Parts
U15  Manufacturer Part Number: ATMEGA2560V-8AU  Manufacturer Name: Microchip Technology / Atmel  [TQFP100]  (hidden comment: 8-bit MicroController)  (part D of 15)

### Ports
PORT_C (in, harness PORT_C)

### Harnesses
PORT_C: PC0, PC1, PC2, PC3, PC4, PC5, PC7, PC6

### Nets
PORT_C.PC0: U15.53(PC0/A8) ; port PORT_C.PC0
PORT_C.PC1: U15.54(PC1/A9) ; port PORT_C.PC1
PORT_C.PC2: U15.55(PC2/A10) ; port PORT_C.PC2
PORT_C.PC3: U15.56(PC3/A11) ; port PORT_C.PC3
PORT_C.PC4: U15.57(PC4/A12) ; port PORT_C.PC4
PORT_C.PC5: U15.58(PC5/A13) ; port PORT_C.PC5
PORT_C.PC6: U15.59(PC6/A14) ; port PORT_C.PC6
PORT_C.PC7: U15.60(PC7/A15) ; port PORT_C.PC7

### Notes on the sheet
- Master MicroController C Port
- Arduino PinOut
  PC0 - 37
  PC1 - 36
  PC2 - 35
  PC3 - 34
  PC4 - 33
  PC5 - 32
  PC6 - 31
  PC7 - 30
- Engineer
- All Rights are reserved to Customer and Engineer. [2021]
- Size:
- Date:
- A4
- Project :
- Time:
- Sheet
- of
- Customer
- Product ID
- Module ID
- Version
- File:
- Revision
- (in symbol IC - ATMEGA2560V-8AU, part D) PORT C

### Library data of the parts
U15 = IC - ATMEGA2560V-8AU: as U15 on sheet Master MicroController Core; Height: 1mm; ComponentLink1Description: DataSheet; ComponentLink1URL: https://eu.mouser.com/datasheet/2/268/Atmel-2549-8-bit-AVR-Microcontroller-ATmega640-128-1315286.pdf; ROHS: Yes; Minimum Operating Temperature: -40; Maximum Operating Temperature: +85; ComponentLink2Description: Mouser; ComponentLink2URL: https://eu.mouser.com/ProductDetail/Microchip-Technology-Atmel/ATMEGA2560V-8AU?qs=sGAEpiMZZMutXGli8Ay4kKlCYcvZUWqJYdtgGFyqFT8%3D; Supplier 1: Digi-Key; Supplier 2: Newark; Supplier 3: Avnet; Supplier 4: RSComponents; Supplier 5: RSComponents; Supplier Part Number 1: ATMEGA2560V-8AU-ND; Supplier Part Number 2: 68T2784; Supplier Part Number 3: 68T2784; Supplier Part Number 4: 1278284P; Supplier Part Number 5: 1278284; Case: TQFP-100; Supplier 6: Mouser; Supplier 7: Future Electronics; Supplier 8: Avnet; Supplier 9: Arrow Electronics; Supplier 10: Farnell; Supplier 11: Allied Electronics; Supplier 12: Future Electronics; Supplier 13: RSComponents; Supplier 14: RSComponents; Supplier 15: RSComponents; Supplier Part Number 6: 556-ATMEGA2560V8AU; Supplier Part Number 7: 4038198; Supplier Part Number 8: ATMEGA2560V-8AU; Supplier Part Number 9: ATMEGA2560V-8AU; Supplier Part Number 10: 1288331; Supplier Part Number 11: 70124009; Supplier Part Number 12: ATMEGA2560V-8AU-TRAY; Supplier Part Number 13: 6963424; Supplier Part Number 14: 6963424P; Supplier Part Number 15: 9220809

## Sheet Master MicroController Port E.SchDoc: Master Micro Controller Port E Pin Out
size A4; ApprovedBy: Mehmet Günce Akkoyun; CheckedBy: Mehmet Günce Akkoyun; Author: Mehmet Günce Akkoyun; CompanyName: Ovoo Electronics; DrawnBy: Mehmet Günce Akkoyun; Engineer: Mehmet Günce Akkoyun; Organization: Ovoo Electronics; Address1: Necip Fazıl Mah. Ortaırmak Sok.; Address2: Birgül Apt. No: 19/6; Address3: Meram / Konya; Address4: Turkiye; DocumentNumber: 20; Revision: R06; SheetNumber: 20; SheetTotal: 54
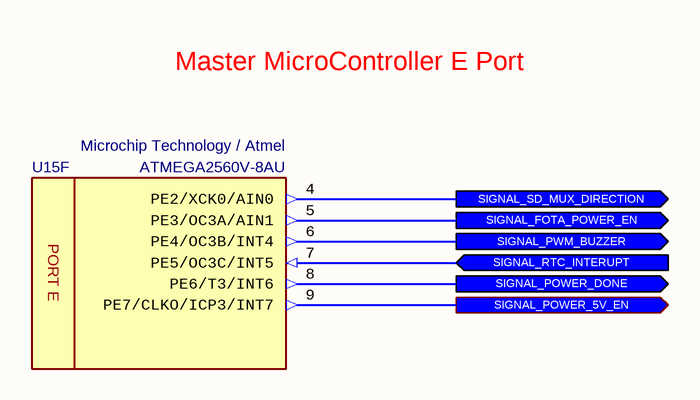
[diagram p24: Master MicroController Port E.SchDoc]

### Parts
U15  Manufacturer Part Number: ATMEGA2560V-8AU  Manufacturer Name: Microchip Technology / Atmel  [TQFP100]  (hidden comment: 8-bit MicroController)  (part F of 15)

### Ports
SIGNAL_FOTA_POWER_EN (out), SIGNAL_POWER_5V_EN (out), SIGNAL_POWER_DONE (out), SIGNAL_PWM_BUZZER (out), SIGNAL_RTC_INTERUPT (in), SIGNAL_SD_MUX_DIRECTION (out)

### Nets
SIGNAL_FOTA_POWER_EN: U15.5(PE3/OC3A/AIN1) ; port SIGNAL_FOTA_POWER_EN
SIGNAL_POWER_5V_EN: U15.9(PE7/CLKO/ICP3/INT7) ; port SIGNAL_POWER_5V_EN
SIGNAL_POWER_DONE: U15.8(PE6/T3/INT6) ; port SIGNAL_POWER_DONE
SIGNAL_PWM_BUZZER: U15.6(PE4/OC3B/INT4) ; port SIGNAL_PWM_BUZZER
SIGNAL_RTC_INTERUPT: U15.7(PE5/OC3C/INT5) ; port SIGNAL_RTC_INTERUPT
SIGNAL_SD_MUX_DIRECTION: U15.4(PE2/XCK0/AIN0) ; port SIGNAL_SD_MUX_DIRECTION

### Notes on the sheet
- Master MicroController E Port
- Engineer
- All Rights are reserved to Customer and Engineer. [2021]
- Size:
- Date:
- A4
- Project :
- Time:
- Sheet
- of
- Customer
- Product ID
- Module ID
- Version
- File:
- Revision
- (in symbol IC - ATMEGA2560V-8AU, part F) PORT E

### Library data of the parts
U15 = IC - ATMEGA2560V-8AU: as U15 on sheet Master MicroController Core; Height: 1mm; ComponentLink1Description: DataSheet; ComponentLink1URL: https://eu.mouser.com/datasheet/2/268/Atmel-2549-8-bit-AVR-Microcontroller-ATmega640-128-1315286.pdf; ROHS: Yes; Minimum Operating Temperature: -40; Maximum Operating Temperature: +85; ComponentLink2Description: Mouser; ComponentLink2URL: https://eu.mouser.com/ProductDetail/Microchip-Technology-Atmel/ATMEGA2560V-8AU?qs=sGAEpiMZZMutXGli8Ay4kKlCYcvZUWqJYdtgGFyqFT8%3D; Supplier 1: Digi-Key; Supplier 2: Newark; Supplier 3: Avnet; Supplier 4: RSComponents; Supplier 5: RSComponents; Supplier Part Number 1: ATMEGA2560V-8AU-ND; Supplier Part Number 2: 68T2784; Supplier Part Number 3: 68T2784; Supplier Part Number 4: 1278284P; Supplier Part Number 5: 1278284; Case: TQFP-100; Supplier 6: Mouser; Supplier 7: Future Electronics; Supplier 8: Avnet; Supplier 9: Arrow Electronics; Supplier 10: Farnell; Supplier 11: Allied Electronics; Supplier 12: Future Electronics; Supplier 13: RSComponents; Supplier 14: RSComponents; Supplier 15: RSComponents; Supplier Part Number 6: 556-ATMEGA2560V8AU; Supplier Part Number 7: 4038198; Supplier Part Number 8: ATMEGA2560V-8AU; Supplier Part Number 9: ATMEGA2560V-8AU; Supplier Part Number 10: 1288331; Supplier Part Number 11: 70124009; Supplier Part Number 12: ATMEGA2560V-8AU-TRAY; Supplier Part Number 13: 6963424; Supplier Part Number 14: 6963424P; Supplier Part Number 15: 9220809

## Sheet Master MicroController Port F.SchDoc: Master Micro Controller Port F Pin Out
size A4; ApprovedBy: Mehmet Günce Akkoyun; CheckedBy: Mehmet Günce Akkoyun; Author: Mehmet Günce Akkoyun; CompanyName: Ovoo Electronics; DrawnBy: Mehmet Günce Akkoyun; Engineer: Mehmet Günce Akkoyun; Organization: Ovoo Electronics; Address1: Necip Fazıl Mah. Ortaırmak Sok.; Address2: Birgül Apt. No: 19/6; Address3: Meram / Konya; Address4: Turkiye; DocumentNumber: 21; Revision: R06; SheetNumber: 21; SheetTotal: 54
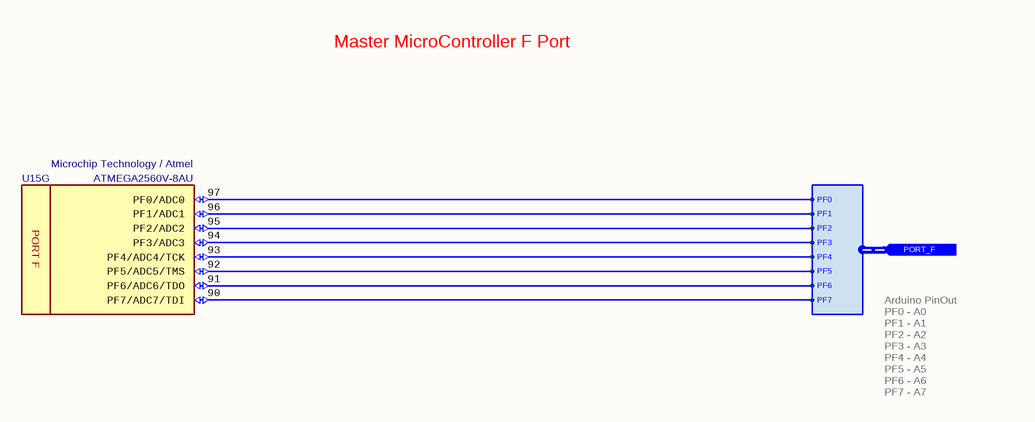
[diagram p25: Master MicroController Port F.SchDoc]

### Parts
U15  Manufacturer Part Number: ATMEGA2560V-8AU  Manufacturer Name: Microchip Technology / Atmel  [TQFP100]  (hidden comment: 8-bit MicroController)  (part G of 15)

### Ports
PORT_F (in, harness PORT_F)

### Harnesses
PORT_F: PF0, PF1, PF2, PF3, PF4, PF5, PF7, PF6

### Nets
PORT_F.PF0: U15.97(PF0/ADC0) ; port PORT_F.PF0
PORT_F.PF1: U15.96(PF1/ADC1) ; port PORT_F.PF1
PORT_F.PF2: U15.95(PF2/ADC2) ; port PORT_F.PF2
PORT_F.PF3: U15.94(PF3/ADC3) ; port PORT_F.PF3
PORT_F.PF4: U15.93(PF4/ADC4/TCK) ; port PORT_F.PF4
PORT_F.PF5: U15.92(PF5/ADC5/TMS) ; port PORT_F.PF5
PORT_F.PF6: U15.91(PF6/ADC6/TDO) ; port PORT_F.PF6
PORT_F.PF7: U15.90(PF7/ADC7/TDI) ; port PORT_F.PF7

### Notes on the sheet
- Master MicroController F Port
- Arduino PinOut
  PF0 - A0
  PF1 - A1
  PF2 - A2
  PF3 - A3
  PF4 - A4
  PF5 - A5
  PF6 - A6
  PF7 - A7
- Engineer
- All Rights are reserved to Customer and Engineer. [2021]
- Size:
- Date:
- A4
- Project :
- Time:
- Sheet
- of
- Customer
- Product ID
- Module ID
- Version
- File:
- Revision
- (in symbol IC - ATMEGA2560V-8AU, part G) PORT F

### Library data of the parts
U15 = IC - ATMEGA2560V-8AU: as U15 on sheet Master MicroController Core; Height: 1mm; ComponentLink1Description: DataSheet; ComponentLink1URL: https://eu.mouser.com/datasheet/2/268/Atmel-2549-8-bit-AVR-Microcontroller-ATmega640-128-1315286.pdf; ROHS: Yes; Minimum Operating Temperature: -40; Maximum Operating Temperature: +85; ComponentLink2Description: Mouser; ComponentLink2URL: https://eu.mouser.com/ProductDetail/Microchip-Technology-Atmel/ATMEGA2560V-8AU?qs=sGAEpiMZZMutXGli8Ay4kKlCYcvZUWqJYdtgGFyqFT8%3D; Supplier 1: Digi-Key; Supplier 2: Newark; Supplier 3: Avnet; Supplier 4: RSComponents; Supplier 5: RSComponents; Supplier Part Number 1: ATMEGA2560V-8AU-ND; Supplier Part Number 2: 68T2784; Supplier Part Number 3: 68T2784; Supplier Part Number 4: 1278284P; Supplier Part Number 5: 1278284; Case: TQFP-100; Supplier 6: Mouser; Supplier 7: Future Electronics; Supplier 8: Avnet; Supplier 9: Arrow Electronics; Supplier 10: Farnell; Supplier 11: Allied Electronics; Supplier 12: Future Electronics; Supplier 13: RSComponents; Supplier 14: RSComponents; Supplier 15: RSComponents; Supplier Part Number 6: 556-ATMEGA2560V8AU; Supplier Part Number 7: 4038198; Supplier Part Number 8: ATMEGA2560V-8AU; Supplier Part Number 9: ATMEGA2560V-8AU; Supplier Part Number 10: 1288331; Supplier Part Number 11: 70124009; Supplier Part Number 12: ATMEGA2560V-8AU-TRAY; Supplier Part Number 13: 6963424; Supplier Part Number 14: 6963424P; Supplier Part Number 15: 9220809

## Sheet Master MicroController Port G.SchDoc: Master Micro Controller Port G Pin Out
size A4; ApprovedBy: Mehmet Günce Akkoyun; CheckedBy: Mehmet Günce Akkoyun; Author: Mehmet Günce Akkoyun; CompanyName: Ovoo Electronics; DrawnBy: Mehmet Günce Akkoyun; Engineer: Mehmet Günce Akkoyun; Organization: Ovoo Electronics; Address1: Necip Fazıl Mah. Ortaırmak Sok.; Address2: Birgül Apt. No: 19/6; Address3: Meram / Konya; Address4: Turkiye; DocumentNumber: 22; Revision: R06; SheetNumber: 22; SheetTotal: 54
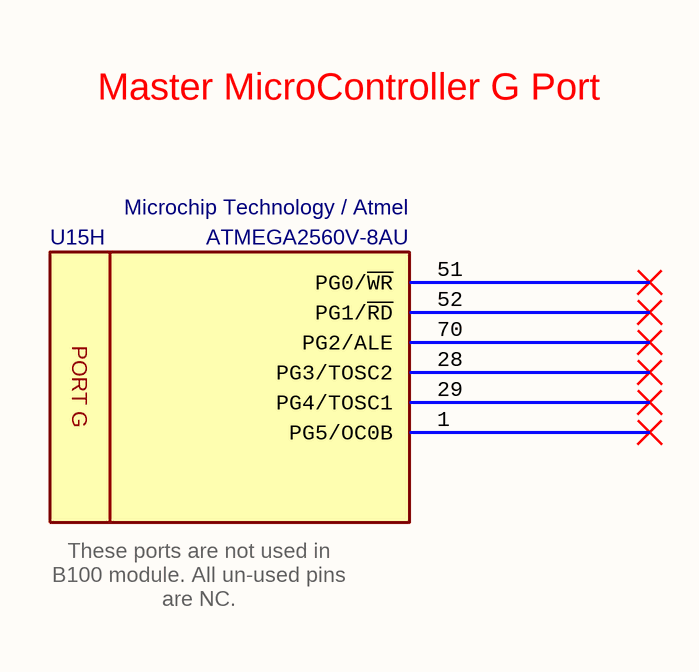
[diagram p26: Master MicroController Port G.SchDoc]

### Parts
U15  Manufacturer Part Number: ATMEGA2560V-8AU  Manufacturer Name: Microchip Technology / Atmel  [TQFP100]  (hidden comment: 8-bit MicroController)  (part H of 15)

### Nets

Not connected (* = marked no-connect by the designer): U15 1(PG5/OC0B)* 28(PG3/TOSC2)* 29(PG4/TOSC1)* 51(PG0/~{WR})* 52(PG1/~{RD})* 70(PG2/ALE)*

### Notes on the sheet
- Master MicroController G Port
- These ports are not used in B100 module. All un-used pins are NC.
- Engineer
- All Rights are reserved to Customer and Engineer. [2021]
- Size:
- Date:
- A4
- Project :
- Time:
- Sheet
- of
- Customer
- Product ID
- Module ID
- Version
- File:
- Revision
- (in symbol IC - ATMEGA2560V-8AU, part H) PORT G

### Library data of the parts
U15 = IC - ATMEGA2560V-8AU: as U15 on sheet Master MicroController Core; Height: 1mm; ComponentLink1Description: DataSheet; ComponentLink1URL: https://eu.mouser.com/datasheet/2/268/Atmel-2549-8-bit-AVR-Microcontroller-ATmega640-128-1315286.pdf; ROHS: Yes; Minimum Operating Temperature: -40; Maximum Operating Temperature: +85; ComponentLink2Description: Mouser; ComponentLink2URL: https://eu.mouser.com/ProductDetail/Microchip-Technology-Atmel/ATMEGA2560V-8AU?qs=sGAEpiMZZMutXGli8Ay4kKlCYcvZUWqJYdtgGFyqFT8%3D; Supplier 1: Digi-Key; Supplier 2: Newark; Supplier 3: Avnet; Supplier 4: RSComponents; Supplier 5: RSComponents; Supplier Part Number 1: ATMEGA2560V-8AU-ND; Supplier Part Number 2: 68T2784; Supplier Part Number 3: 68T2784; Supplier Part Number 4: 1278284P; Supplier Part Number 5: 1278284; Case: TQFP-100; Supplier 6: Mouser; Supplier 7: Future Electronics; Supplier 8: Avnet; Supplier 9: Arrow Electronics; Supplier 10: Farnell; Supplier 11: Allied Electronics; Supplier 12: Future Electronics; Supplier 13: RSComponents; Supplier 14: RSComponents; Supplier 15: RSComponents; Supplier Part Number 6: 556-ATMEGA2560V8AU; Supplier Part Number 7: 4038198; Supplier Part Number 8: ATMEGA2560V-8AU; Supplier Part Number 9: ATMEGA2560V-8AU; Supplier Part Number 10: 1288331; Supplier Part Number 11: 70124009; Supplier Part Number 12: ATMEGA2560V-8AU-TRAY; Supplier Part Number 13: 6963424; Supplier Part Number 14: 6963424P; Supplier Part Number 15: 9220809

## Sheet Master MicroController Port H.SchDoc: Master Micro Controller Port H Pin Out
size A4; ApprovedBy: Mehmet Günce Akkoyun; CheckedBy: Mehmet Günce Akkoyun; Author: Mehmet Günce Akkoyun; CompanyName: Ovoo Electronics; DrawnBy: Mehmet Günce Akkoyun; Engineer: Mehmet Günce Akkoyun; Organization: Ovoo Electronics; Address1: Necip Fazıl Mah. Ortaırmak Sok.; Address2: Birgül Apt. No: 19/6; Address3: Meram / Konya; Address4: Turkiye; DocumentNumber: 23; Revision: R06; SheetNumber: 23; SheetTotal: 54
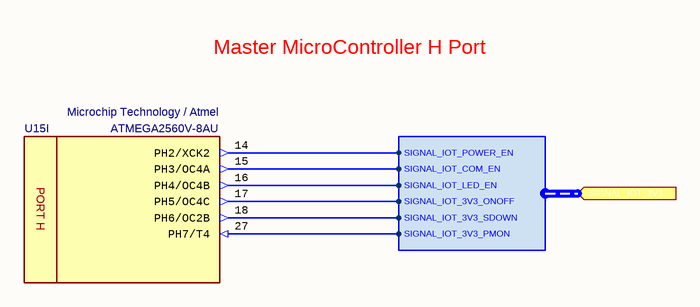
[diagram p27: Master MicroController Port H.SchDoc]

### Parts
U15  Manufacturer Part Number: ATMEGA2560V-8AU  Manufacturer Name: Microchip Technology / Atmel  [TQFP100]  (hidden comment: 8-bit MicroController)  (part I of 15)

### Ports
SIGNAL_IOT_3V3 (in, harness SIGNAL_IOT_3V3)

### Harnesses
SIGNAL_IOT_3V3: SIGNAL_IOT_COM_EN, SIGNAL_IOT_POWER_EN, SIGNAL_IOT_LED_EN, SIGNAL_IOT_3V3_SDOWN, SIGNAL_IOT_3V3_ONOFF, SIGNAL_IOT_3V3_PMON

### Nets
SIGNAL_IOT_3V3.SIGNAL_IOT_3V3_ONOFF: U15.17(PH5/OC4C) ; port SIGNAL_IOT_3V3.SIGNAL_IOT_3V3_ONOFF
SIGNAL_IOT_3V3.SIGNAL_IOT_3V3_PMON: U15.27(PH7/T4) ; port SIGNAL_IOT_3V3.SIGNAL_IOT_3V3_PMON
SIGNAL_IOT_3V3.SIGNAL_IOT_3V3_SDOWN: U15.18(PH6/OC2B) ; port SIGNAL_IOT_3V3.SIGNAL_IOT_3V3_SDOWN
SIGNAL_IOT_3V3.SIGNAL_IOT_COM_EN: U15.15(PH3/OC4A) ; port SIGNAL_IOT_3V3.SIGNAL_IOT_COM_EN
SIGNAL_IOT_3V3.SIGNAL_IOT_LED_EN: U15.16(PH4/OC4B) ; port SIGNAL_IOT_3V3.SIGNAL_IOT_LED_EN
SIGNAL_IOT_3V3.SIGNAL_IOT_POWER_EN: U15.14(PH2/XCK2) ; port SIGNAL_IOT_3V3.SIGNAL_IOT_POWER_EN

### Notes on the sheet
- Master MicroController H Port
- Engineer
- All Rights are reserved to Customer and Engineer. [2021]
- Size:
- Date:
- A4
- Project :
- Time:
- Sheet
- of
- Customer
- Product ID
- Module ID
- Version
- File:
- Revision
- (in symbol IC - ATMEGA2560V-8AU, part I) PORT H

### Library data of the parts
U15 = IC - ATMEGA2560V-8AU: as U15 on sheet Master MicroController Core; Height: 1mm; ComponentLink1Description: DataSheet; ComponentLink1URL: https://eu.mouser.com/datasheet/2/268/Atmel-2549-8-bit-AVR-Microcontroller-ATmega640-128-1315286.pdf; ROHS: Yes; Minimum Operating Temperature: -40; Maximum Operating Temperature: +85; ComponentLink2Description: Mouser; ComponentLink2URL: https://eu.mouser.com/ProductDetail/Microchip-Technology-Atmel/ATMEGA2560V-8AU?qs=sGAEpiMZZMutXGli8Ay4kKlCYcvZUWqJYdtgGFyqFT8%3D; Supplier 1: Digi-Key; Supplier 2: Newark; Supplier 3: Avnet; Supplier 4: RSComponents; Supplier 5: RSComponents; Supplier Part Number 1: ATMEGA2560V-8AU-ND; Supplier Part Number 2: 68T2784; Supplier Part Number 3: 68T2784; Supplier Part Number 4: 1278284P; Supplier Part Number 5: 1278284; Case: TQFP-100; Supplier 6: Mouser; Supplier 7: Future Electronics; Supplier 8: Avnet; Supplier 9: Arrow Electronics; Supplier 10: Farnell; Supplier 11: Allied Electronics; Supplier 12: Future Electronics; Supplier 13: RSComponents; Supplier 14: RSComponents; Supplier 15: RSComponents; Supplier Part Number 6: 556-ATMEGA2560V8AU; Supplier Part Number 7: 4038198; Supplier Part Number 8: ATMEGA2560V-8AU; Supplier Part Number 9: ATMEGA2560V-8AU; Supplier Part Number 10: 1288331; Supplier Part Number 11: 70124009; Supplier Part Number 12: ATMEGA2560V-8AU-TRAY; Supplier Part Number 13: 6963424; Supplier Part Number 14: 6963424P; Supplier Part Number 15: 9220809

## Sheet Master MicroController Port K.SchDoc: Master Micro Controller Port K Pin Out
size A4; ApprovedBy: Mehmet Günce Akkoyun; CheckedBy: Mehmet Günce Akkoyun; Author: Mehmet Günce Akkoyun; CompanyName: Ovoo Electronics; DrawnBy: Mehmet Günce Akkoyun; Engineer: Mehmet Günce Akkoyun; Organization: Ovoo Electronics; Address1: Necip Fazıl Mah. Ortaırmak Sok.; Address2: Birgül Apt. No: 19/6; Address3: Meram / Konya; Address4: Turkiye; DocumentNumber: 25; Revision: R06; SheetNumber: 25; SheetTotal: 54
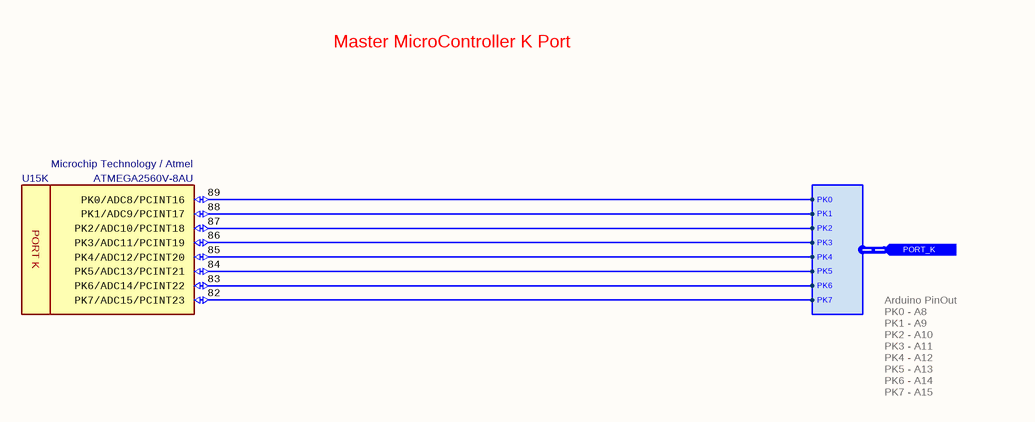
[diagram p28: Master MicroController Port K.SchDoc]

### Parts
U15  Manufacturer_Part_Number: ATMEGA2560V-8AU  Manufacturer_Name: Microchip Technology / Atmel  [TQFP100]  (hidden comment: 8-bit MicroController)  (part K of 15)

### Ports
PORT_K (in, harness PORT_K)

### Harnesses
PORT_K: PK0, PK1, PK2, PK3, PK4, PK5, PK7, PK6

### Nets
PORT_K.PK0: U15.89(PK0/ADC8/PCINT16) ; port PORT_K.PK0
PORT_K.PK1: U15.88(PK1/ADC9/PCINT17) ; port PORT_K.PK1
PORT_K.PK2: U15.87(PK2/ADC10/PCINT18) ; port PORT_K.PK2
PORT_K.PK3: U15.86(PK3/ADC11/PCINT19) ; port PORT_K.PK3
PORT_K.PK4: U15.85(PK4/ADC12/PCINT20) ; port PORT_K.PK4
PORT_K.PK5: U15.84(PK5/ADC13/PCINT21) ; port PORT_K.PK5
PORT_K.PK6: U15.83(PK6/ADC14/PCINT22) ; port PORT_K.PK6
PORT_K.PK7: U15.82(PK7/ADC15/PCINT23) ; port PORT_K.PK7

### Notes on the sheet
- Master MicroController K Port
- Arduino PinOut
  PK0 - A8
  PK1 - A9
  PK2 - A10
  PK3 - A11
  PK4 - A12
  PK5 - A13
  PK6 - A14
  PK7 - A15
- Title
- Size:
- Date:
- A4
- Number:
- Time:
- Revision:
- Sheet
- of
- File:
- (in symbol IC - ATMEGA2560V-8AU, part K) PORT K

### Library data of the parts
U15 = IC - ATMEGA2560V-8AU: as U15 on sheet Master MicroController Core; Height: 1mm; Mouser_Part_Number: 556-ATMEGA2560V8AU; ComponentLink1Description: DataSheet; ComponentLink1URL: https://eu.mouser.com/datasheet/2/268/Atmel-2549-8-bit-AVR-Microcontroller-ATmega640-128-1315286.pdf; ROHS: Yes; Minimum Operating Temperature: -40; Maximum Operating Temperature: +85; ComponentLink2Description: Mouser; ComponentLink2URL: https://eu.mouser.com/ProductDetail/Microchip-Technology-Atmel/ATMEGA2560V-8AU?qs=sGAEpiMZZMutXGli8Ay4kKlCYcvZUWqJYdtgGFyqFT8%3D; Supplier 1: Mouser; Supplier 2: Arrow; Supplier 3: Farnell; Supplier 4: Newark; Supplier 5: Digi-Key; Supplier Part Number 1: 556-ATMEGA2560V8AU; Supplier Part Number 2: ATMEGA2560V-8AU; Supplier Part Number 3: 1288331; Supplier Part Number 4: 68T2784; Supplier Part Number 5: ATMEGA2560V-8AU-ND; Case: TQFP-100

## Sheet Master MicroController Port L.SchDoc: Master Micro Controller Port L Pin Out
size A4; ApprovedBy: Mehmet Günce Akkoyun; CheckedBy: Mehmet Günce Akkoyun; Author: Mehmet Günce Akkoyun; CompanyName: Ovoo Electronics; DrawnBy: Mehmet Günce Akkoyun; Engineer: Mehmet Günce Akkoyun; Organization: Ovoo Electronics; Address1: Necip Fazıl Mah. Ortaırmak Sok.; Address2: Birgül Apt. No: 19/6; Address3: Meram / Konya; Address4: Turkiye; DocumentNumber: 26; Revision: R06; SheetNumber: 26; SheetTotal: 54
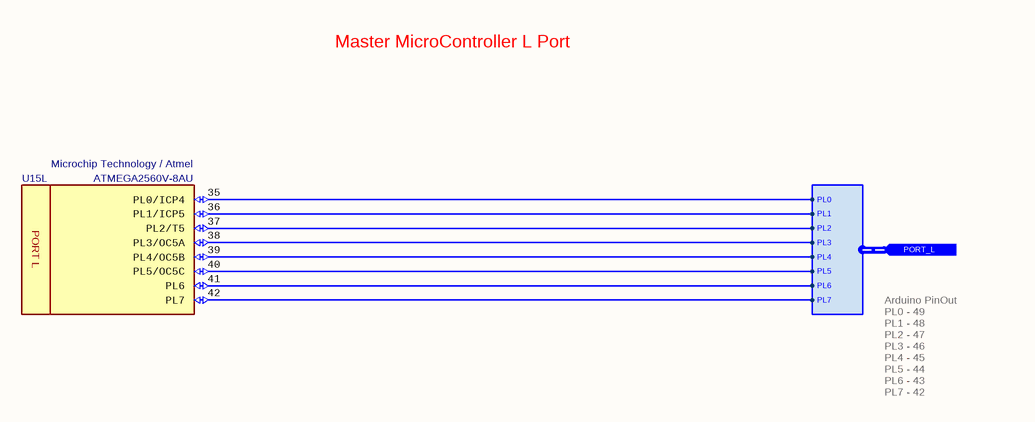
[diagram p29: Master MicroController Port L.SchDoc]

### Parts
U15  Manufacturer Part Number: ATMEGA2560V-8AU  Manufacturer Name: Microchip Technology / Atmel  [TQFP100]  (hidden comment: 8-bit MicroController)  (part L of 15)

### Ports
PORT_L (in, harness PORT_L)

### Harnesses
PORT_L: PL0, PL1, PL2, PL3, PL4, PL5, PL7, PL6

### Nets
PORT_L.PL0: U15.35(PL0/ICP4) ; port PORT_L.PL0
PORT_L.PL1: U15.36(PL1/ICP5) ; port PORT_L.PL1
PORT_L.PL2: U15.37(PL2/T5) ; port PORT_L.PL2
PORT_L.PL3: U15.38(PL3/OC5A) ; port PORT_L.PL3
PORT_L.PL4: U15.39(PL4/OC5B) ; port PORT_L.PL4
PORT_L.PL5: U15.40(PL5/OC5C) ; port PORT_L.PL5
PORT_L.PL6: U15.41(PL6) ; port PORT_L.PL6
PORT_L.PL7: U15.42(PL7) ; port PORT_L.PL7

### Notes on the sheet
- Master MicroController L Port
- Arduino PinOut
  PL0 - 49
  PL1 - 48
  PL2 - 47
  PL3 - 46
  PL4 - 45
  PL5 - 44
  PL6 - 43
  PL7 - 42
- Engineer
- All Rights are reserved to Customer and Engineer. [2021]
- Size:
- Date:
- A4
- Project :
- Time:
- Sheet
- of
- Customer
- Product ID
- Module ID
- Version
- File:
- Revision
- (in symbol IC - ATMEGA2560V-8AU, part L) PORT L

### Library data of the parts
U15 = IC - ATMEGA2560V-8AU: as U15 on sheet Master MicroController Core; Height: 1mm; ComponentLink1Description: DataSheet; ComponentLink1URL: https://eu.mouser.com/datasheet/2/268/Atmel-2549-8-bit-AVR-Microcontroller-ATmega640-128-1315286.pdf; ROHS: Yes; Minimum Operating Temperature: -40; Maximum Operating Temperature: +85; ComponentLink2Description: Mouser; ComponentLink2URL: https://eu.mouser.com/ProductDetail/Microchip-Technology-Atmel/ATMEGA2560V-8AU?qs=sGAEpiMZZMutXGli8Ay4kKlCYcvZUWqJYdtgGFyqFT8%3D; Supplier 1: Digi-Key; Supplier 2: Newark; Supplier 3: Avnet; Supplier 4: RSComponents; Supplier 5: RSComponents; Supplier Part Number 1: ATMEGA2560V-8AU-ND; Supplier Part Number 2: 68T2784; Supplier Part Number 3: 68T2784; Supplier Part Number 4: 1278284P; Supplier Part Number 5: 1278284; Case: TQFP-100; Supplier 6: Mouser; Supplier 7: Future Electronics; Supplier 8: Avnet; Supplier 9: Arrow Electronics; Supplier 10: Farnell; Supplier 11: Allied Electronics; Supplier 12: Future Electronics; Supplier 13: RSComponents; Supplier 14: RSComponents; Supplier 15: RSComponents; Supplier Part Number 6: 556-ATMEGA2560V8AU; Supplier Part Number 7: 4038198; Supplier Part Number 8: ATMEGA2560V-8AU; Supplier Part Number 9: ATMEGA2560V-8AU; Supplier Part Number 10: 1288331; Supplier Part Number 11: 70124009; Supplier Part Number 12: ATMEGA2560V-8AU-TRAY; Supplier Part Number 13: 6963424; Supplier Part Number 14: 6963424P; Supplier Part Number 15: 9220809

## Sheet Master MicroController Port J.SchDoc: Master Micro Controller Port J Pin Out
size A4; ApprovedBy: Mehmet Günce Akkoyun; CheckedBy: Mehmet Günce Akkoyun; Author: Mehmet Günce Akkoyun; CompanyName: Ovoo Electronics; DrawnBy: Mehmet Günce Akkoyun; Engineer: Mehmet Günce Akkoyun; Organization: Ovoo Electronics; Address1: Necip Fazıl Mah. Ortaırmak Sok.; Address2: Birgül Apt. No: 19/6; Address3: Meram / Konya; Address4: Turkiye; DocumentNumber: 24; Revision: R06; SheetNumber: 24; SheetTotal: 54
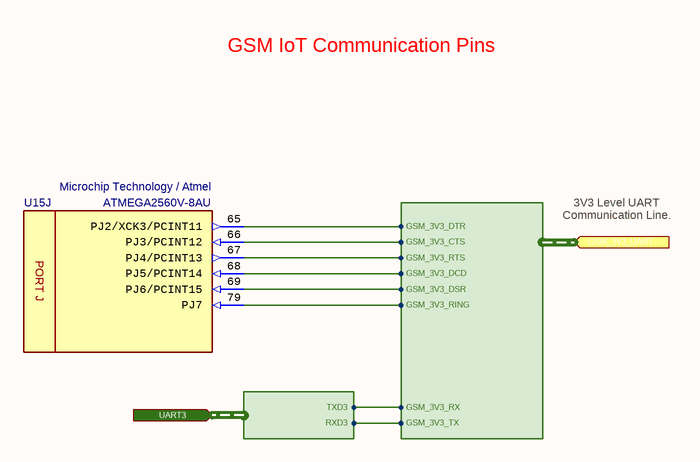
[diagram p30: Master MicroController Port J.SchDoc]

### Parts
U15  Manufacturer Part Number: ATMEGA2560V-8AU  Manufacturer Name: Microchip Technology / Atmel  [TQFP100]  (hidden comment: 8-bit MicroController)  (part J of 15)

### Ports
GSM_3V3_UART (in, harness GSM_3V3_UART), UART3 (in, harness UART3)

### Harnesses
GSM_3V3_UART: GSM_3V3_RX, GSM_3V3_TX, GSM_3V3_DTR, GSM_3V3_RTS, GSM_3V3_CTS, GSM_3V3_DCD, GSM_3V3_DSR, GSM_3V3_RING
UART3: RXD3, TXD3

### Nets
GSM_3V3_UART.GSM_3V3_CTS: U15.66(PJ3/PCINT12) ; port GSM_3V3_UART.GSM_3V3_CTS
GSM_3V3_UART.GSM_3V3_DCD: U15.68(PJ5/PCINT14) ; port GSM_3V3_UART.GSM_3V3_DCD
GSM_3V3_UART.GSM_3V3_DSR: U15.69(PJ6/PCINT15) ; port GSM_3V3_UART.GSM_3V3_DSR
GSM_3V3_UART.GSM_3V3_DTR: U15.65(PJ2/XCK3/PCINT11) ; port GSM_3V3_UART.GSM_3V3_DTR
GSM_3V3_UART.GSM_3V3_RING: U15.79(PJ7) ; port GSM_3V3_UART.GSM_3V3_RING
GSM_3V3_UART.GSM_3V3_RTS: U15.67(PJ4/PCINT13) ; port GSM_3V3_UART.GSM_3V3_RTS
GSM_3V3_UART.GSM_3V3_RX: port GSM_3V3_UART.GSM_3V3_RX, port UART3.TXD3
GSM_3V3_UART.GSM_3V3_TX: port GSM_3V3_UART.GSM_3V3_TX, port UART3.RXD3

### Notes on the sheet
- GSM IoT Communication Pins
- 3V3 Level UART Communication Line.
- Engineer
- All Rights are reserved to Customer and Engineer. [2021]
- Size:
- Date:
- A4
- Project :
- Time:
- Sheet
- of
- Customer
- Product ID
- Module ID
- Version
- File:
- Revision
- (in symbol IC - ATMEGA2560V-8AU, part J) PORT J

### Library data of the parts
U15 = IC - ATMEGA2560V-8AU: as U15 on sheet Master MicroController Core; Height: 1mm; ComponentLink1Description: DataSheet; ComponentLink1URL: https://eu.mouser.com/datasheet/2/268/Atmel-2549-8-bit-AVR-Microcontroller-ATmega640-128-1315286.pdf; ROHS: Yes; Minimum Operating Temperature: -40; Maximum Operating Temperature: +85; ComponentLink2Description: Mouser; ComponentLink2URL: https://eu.mouser.com/ProductDetail/Microchip-Technology-Atmel/ATMEGA2560V-8AU?qs=sGAEpiMZZMutXGli8Ay4kKlCYcvZUWqJYdtgGFyqFT8%3D; Supplier 1: Digi-Key; Supplier 2: Newark; Supplier 3: Avnet; Supplier 4: RSComponents; Supplier 5: RSComponents; Supplier Part Number 1: ATMEGA2560V-8AU-ND; Supplier Part Number 2: 68T2784; Supplier Part Number 3: 68T2784; Supplier Part Number 4: 1278284P; Supplier Part Number 5: 1278284; Case: TQFP-100; Supplier 6: Mouser; Supplier 7: Future Electronics; Supplier 8: Avnet; Supplier 9: Arrow Electronics; Supplier 10: Farnell; Supplier 11: Allied Electronics; Supplier 12: Future Electronics; Supplier 13: RSComponents; Supplier 14: RSComponents; Supplier 15: RSComponents; Supplier Part Number 6: 556-ATMEGA2560V8AU; Supplier Part Number 7: 4038198; Supplier Part Number 8: ATMEGA2560V-8AU; Supplier Part Number 9: ATMEGA2560V-8AU; Supplier Part Number 10: 1288331; Supplier Part Number 11: 70124009; Supplier Part Number 12: ATMEGA2560V-8AU-TRAY; Supplier Part Number 13: 6963424; Supplier Part Number 14: 6963424P; Supplier Part Number 15: 9220809